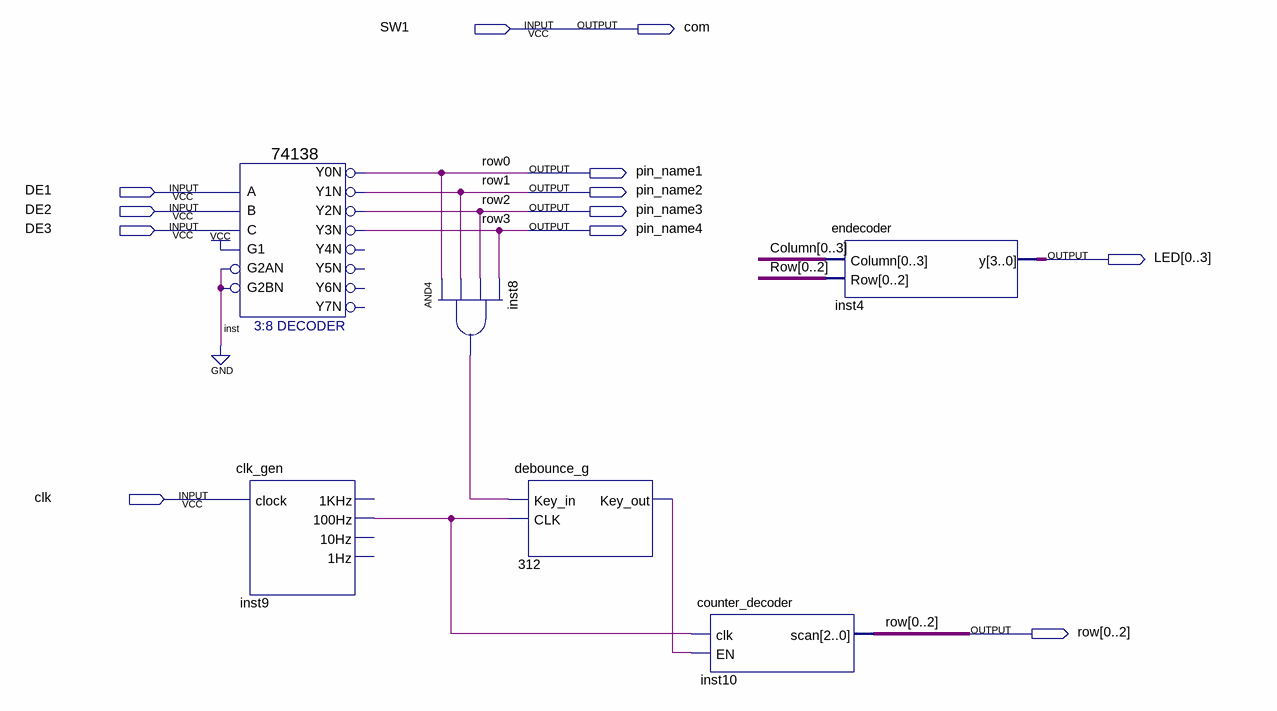
[diagram p0: schematic sheet]
// Quartus schematic test.bdf as structural Verilog: 6 symbols, 12 pins
module test (
  input  SW1,
  input  DE1,
  input  DE2,
  input  DE3,
  input  clk,
  output com,
  output pin_name1,
  output pin_name2,
  output pin_name3,
  output pin_name4,
  output [0:3] LED,
  output [0:2] row
);

  wire inst8_out, inst9_100hz, n312_key_out;
  wire [3:0] Column;

  \74138  inst (
    .A(DE1), .B(DE2), .G1(1'b1), .C(DE3), .G2AN(1'b0), .G2BN(1'b0), .Y0N(pin_name1), .Y1N(pin_name2),
    .Y2N(pin_name3), .Y3N(pin_name4));  // open: Y4N, Y5N, Y6N, Y7N
  clk_gen inst9 (.clock(clk), .\100Hz (inst9_100hz));  // open: 1KHz, 10Hz, 1Hz
  and inst8 (inst8_out, pin_name1, pin_name2, pin_name3, pin_name4);
  debounce_g u_312 (.Key_in(inst8_out), .CLK(inst9_100hz), .Key_out(n312_key_out));
  counter_decoder inst10 (.clk(inst9_100hz), .EN(n312_key_out), .scan({pin_name1, pin_name2, pin_name3}));
  endecoder inst4 (
    .Column({Column[0], Column[1], Column[2], Column[3]}), .Row({pin_name1, pin_name2, pin_name3}), .y(LED));

  assign com = SW1;
  assign row = {pin_name1, pin_name2, pin_name3};

  // Other names for the same wires on the sheet: row0 = pin_name1; row1 = pin_name2; row2 = pin_name3;
  //   row3 = pin_name4
endmodule
